# Altium schematic sheet mcu1_secondary.SchDoc: foxBMS BMS-Master
size A3; DocumentNumber: 11; SheetNumber: 11; SheetTotal: 24; Author: Fraunhofer IISB foxBMS Team; REL-DATE: 2017-05-16; VERSION: 1.0.2; SheetDescription: MCU1 (Secondary); ClassName: ISO_MCU_SEC
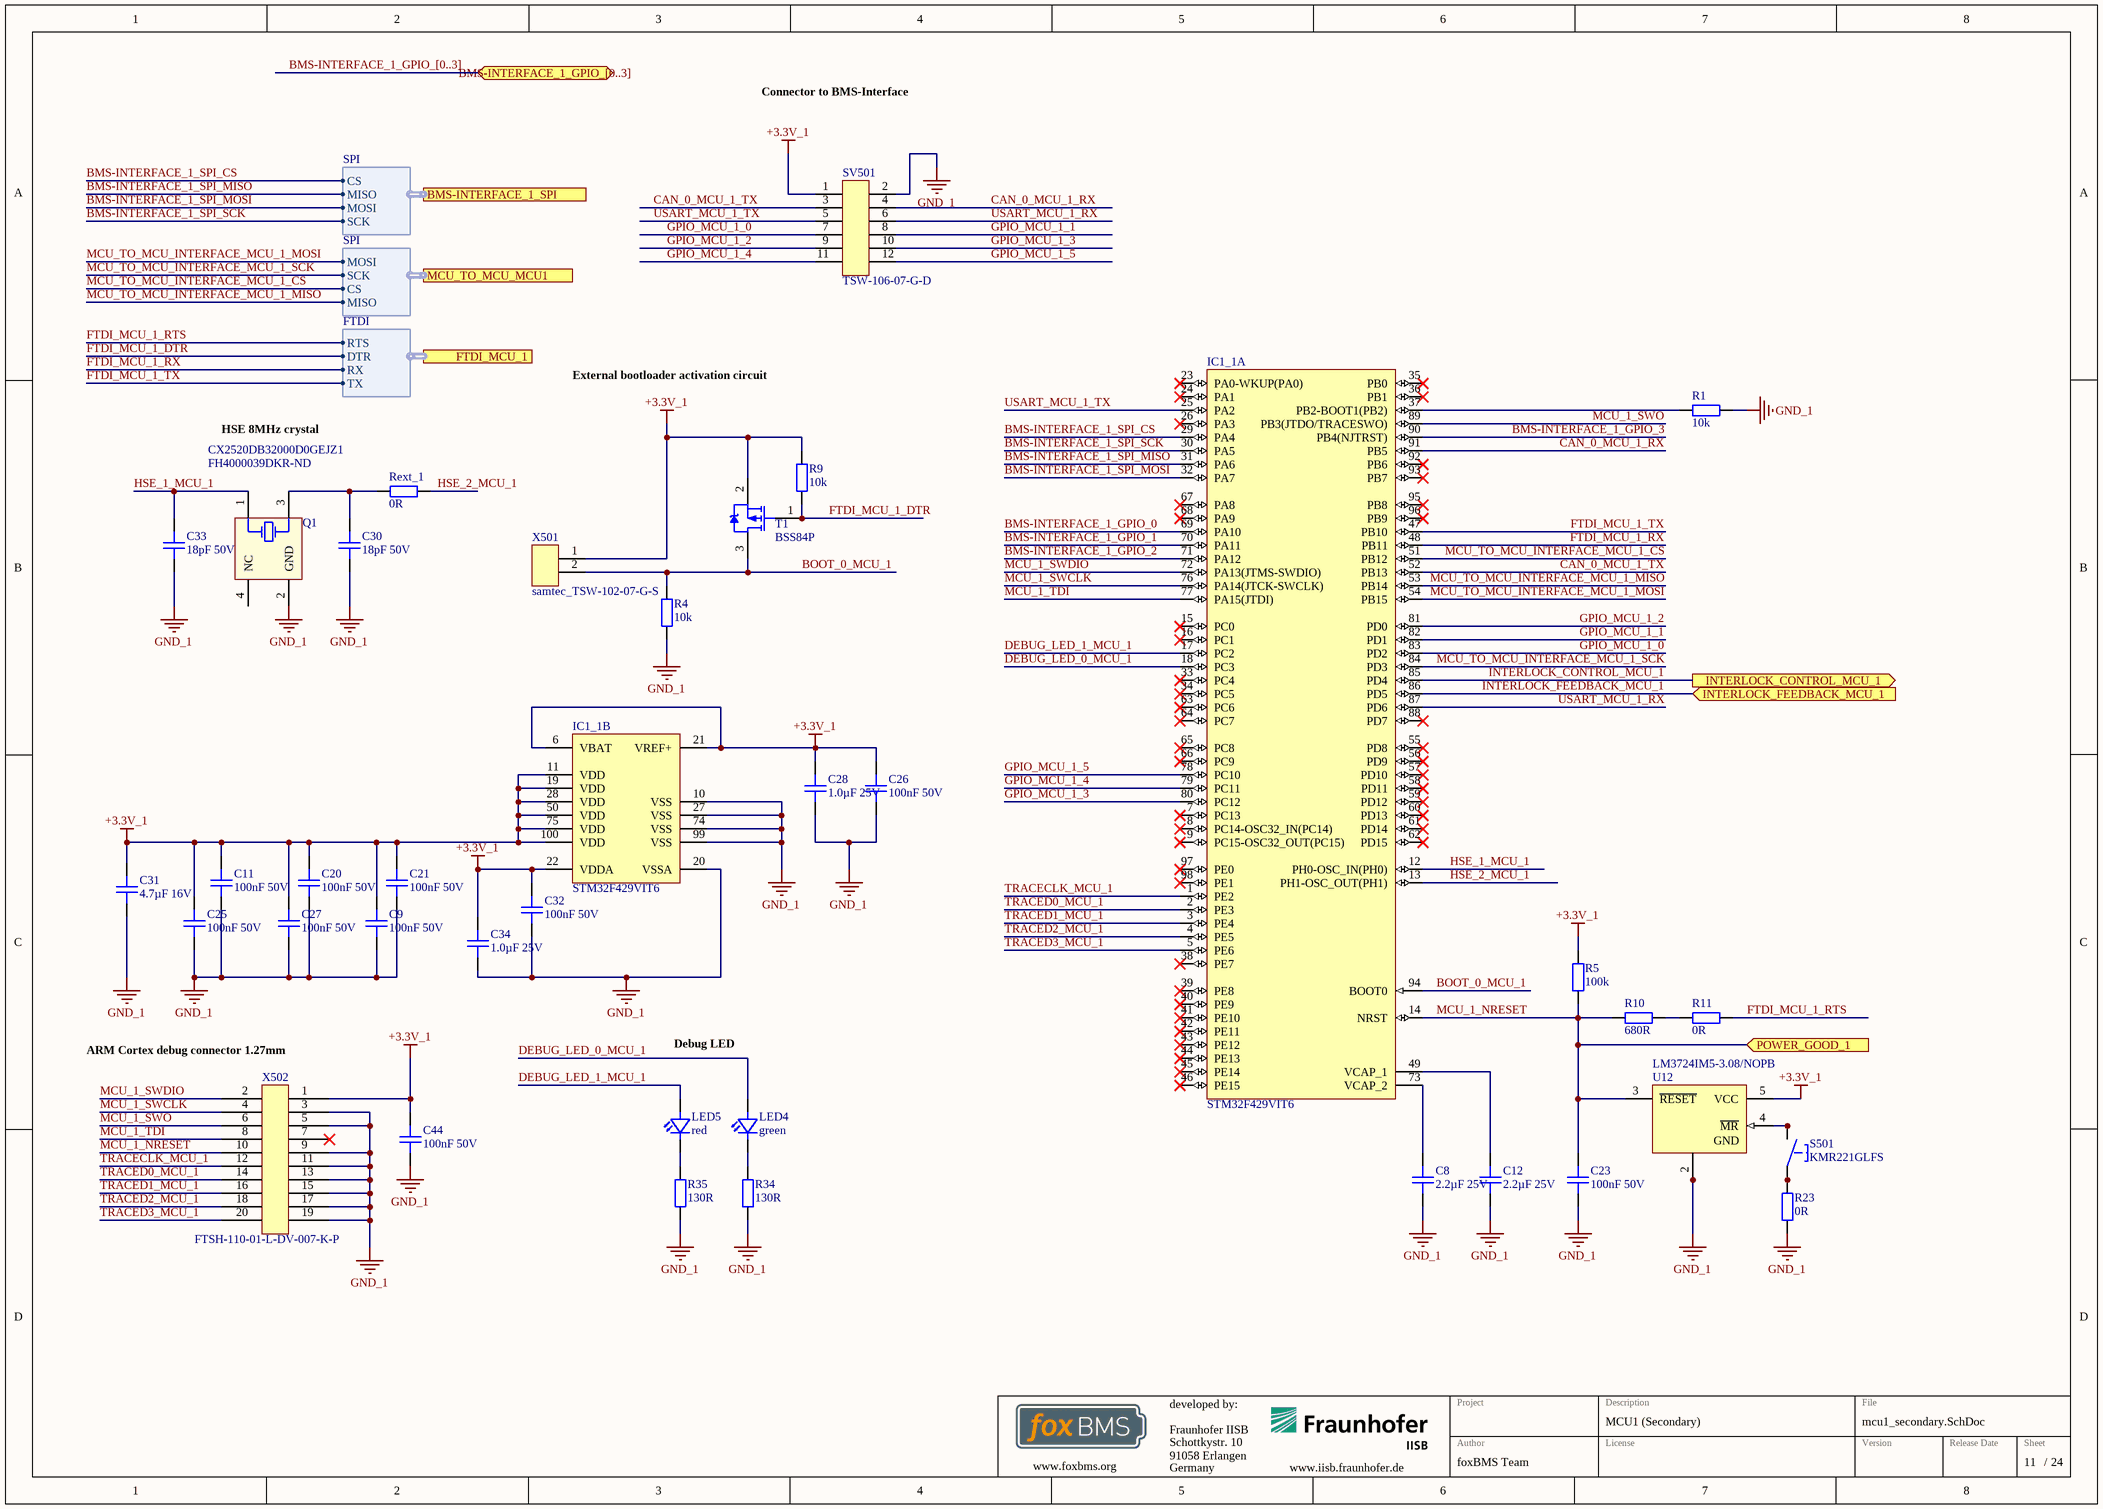
[diagram p0: mcu1_secondary.SchDoc]

## Parts
C8  2.2µF 25V  [0805C]
C9  100nF 50V  [0402C]
C11  100nF 50V  [0402C]
C12  2.2µF 25V  [0805C]
C20  100nF 50V  [0402C]
C21  100nF 50V  [0402C]
C23  100nF 50V  [0603C]
C25  100nF 50V  [0402C]
C26  100nF 50V  [0402C]
C27  100nF 50V  [0402C]
C28  1.0µF 25V  [0603C]
C30  18pF 50V  [0402C]
C31  4.7µF 16V  [0805C]
C32  100nF 50V  [0402C]
C33  18pF 50V  [0402C]
C34  1.0µF 25V  [0603C]
C44  100nF 50V  [0603C]
IC1_1  STM32F429VIT6  [STM-LQFP100_N]  (parts A,B of 2)
LED4  green  [LEDC1608X07N]
LED5  red  [LEDC1608X07N]
Q1  CX2520DB32000D0GEJZ1  Supplier Part Number 1: FH4000039DKR-ND  [AVX-CX2520DB32000D0GEJZ1-4_V]
R1  10k  [0603R]
R4  10k  [0603R]
R5  100k  [0603R]
R9  10k  [0603R]
R10  680R  [0603R]
R11  0R  [0603R]
R23  0R  [0603R]
R34  130R  [0603R]
R35  130R  [0603R]
Rext_1  0R  [0402R]
S501  KMR221GLFS  [KMR2_Series]
SV501  TSW-106-07-G-D  [Pinheader_2.54_2x6]
T1  BSS84P  [INF-PG-SOT23_N]
U12  LM3724IM5-3.08/NOPB  [MF05A_N]
X501  samtec_TSW-102-07-G-S  [Pinheader_2.54_2]
X502  FTSH-110-01-L-DV-007-K-P  [CORTEX_DEBUG_20_PIN]

## Ports
BMS-INTERFACE_1_GPIO_[0..3] (bidir), BMS-INTERFACE_1_SPI (harness SPI), FTDI_MCU_1 (harness FTDI), INTERLOCK_CONTROL_MCU_1 (out), INTERLOCK_FEEDBACK_MCU_1 (in), MCU_TO_MCU_MCU1 (harness SPI), POWER_GOOD_1 (in)

## Harnesses
SPI: CS, MISO, MOSI, SCK
FTDI: RTS, DTR, RX, TX

## Nets
+3.3V_1: C9.1 C11.1 C20.1 C21.1 C25.1 C26.1 C27.1 C28.1 C31.1 C32.1 C34.1 C44.1 IC1_1.6(VBAT) IC1_1.11(VDD) IC1_1.19(VDD) IC1_1.21(VREF+) IC1_1.22(VDDA) IC1_1.28(VDD) IC1_1.50(VDD) IC1_1.75(VDD) IC1_1.100(VDD) R5.2 R9.2 SV501.1 T1.2(SOURCE) U12.5(VCC) X501.1 X502.1
GND_1: C8.2 C9.2 C11.2 C12.2 C20.2 C21.2 C23.2 C25.2 C26.2 C27.2 C28.2 C30.2 C31.2 C32.2 C33.1 C34.2 C44.2 IC1_1.10(VSS) IC1_1.20(VSSA) IC1_1.27(VSS) IC1_1.74(VSS) IC1_1.99(VSS) Q1.2(GND) R1.1 R4.1 R23.1 R34.1 R35.1 SV501.2 U12.1(GND) U12.2(GND) X502.3 X502.5 X502.9 X502.11 X502.13 X502.15 X502.17 X502.19
BMS-INTERFACE_1_GPIO_0: IC1_1.69(PA10)
BMS-INTERFACE_1_GPIO_1: IC1_1.70(PA11)
BMS-INTERFACE_1_GPIO_2: IC1_1.71(PA12)
BMS-INTERFACE_1_GPIO_3: IC1_1.90(PB4(NJTRST))
BMS-INTERFACE_1_SPI_CS: IC1_1.29(PA4) ; port BMS-INTERFACE_1_SPI.CS
BMS-INTERFACE_1_SPI_MISO: IC1_1.31(PA6) ; port BMS-INTERFACE_1_SPI.MISO
BMS-INTERFACE_1_SPI_MOSI: IC1_1.32(PA7) ; port BMS-INTERFACE_1_SPI.MOSI
BMS-INTERFACE_1_SPI_SCK: IC1_1.30(PA5) ; port BMS-INTERFACE_1_SPI.SCK
BOOT_0_MCU_1: IC1_1.94(BOOT0) R4.2 T1.3(DRAIN) X501.2
CAN_0_MCU_1_RX: IC1_1.91(PB5) SV501.4
CAN_0_MCU_1_TX: IC1_1.52(PB13) SV501.3
DEBUG_LED_0_MCU_1: IC1_1.18(PC3) LED4.2(A)
DEBUG_LED_1_MCU_1: IC1_1.17(PC2) LED5.2(A)
FTDI_MCU_1_DTR: R9.1 T1.1(GATE) ; port FTDI_MCU_1.DTR
FTDI_MCU_1_RTS: R11.2 ; port FTDI_MCU_1.RTS
FTDI_MCU_1_RX: IC1_1.48(PB11) ; port FTDI_MCU_1.RX
FTDI_MCU_1_TX: IC1_1.47(PB10) ; port FTDI_MCU_1.TX
GPIO_MCU_1_0: IC1_1.83(PD2) SV501.7
GPIO_MCU_1_1: IC1_1.82(PD1) SV501.8
GPIO_MCU_1_2: IC1_1.81(PD0) SV501.9
GPIO_MCU_1_3: IC1_1.80(PC12) SV501.10
GPIO_MCU_1_4: IC1_1.79(PC11) SV501.11
GPIO_MCU_1_5: IC1_1.78(PC10) SV501.12
HSE_1_MCU_1: C33.2 IC1_1.12(PH0-OSC_IN(PH0)) Q1.1(HOT)
HSE_2_MCU_1: IC1_1.13(PH1-OSC_OUT(PH1)) Rext_1.1
INTERLOCK_CONTROL_MCU_1: IC1_1.85(PD4) ; port INTERLOCK_CONTROL_MCU_1
INTERLOCK_FEEDBACK_MCU_1: IC1_1.86(PD5) ; port INTERLOCK_FEEDBACK_MCU_1
MCU_1_NRESET: C23.1 IC1_1.14(NRST) R5.1 R10.1 U12.3(~{RESET}) X502.10 ; port POWER_GOOD_1
MCU_1_SWCLK: IC1_1.76(PA14(JTCK-SWCLK)) X502.4
MCU_1_SWDIO: IC1_1.72(PA13(JTMS-SWDIO)) X502.2
MCU_1_SWO: IC1_1.89(PB3(JTDO/TRACESWO)) X502.6
MCU_1_TDI: IC1_1.77(PA15(JTDI)) X502.8
MCU_TO_MCU_INTERFACE_MCU_1_CS: IC1_1.51(PB12) ; port MCU_TO_MCU_MCU1.CS
MCU_TO_MCU_INTERFACE_MCU_1_MISO: IC1_1.53(PB14) ; port MCU_TO_MCU_MCU1.MISO
MCU_TO_MCU_INTERFACE_MCU_1_MOSI: IC1_1.54(PB15) ; port MCU_TO_MCU_MCU1.MOSI
MCU_TO_MCU_INTERFACE_MCU_1_SCK: IC1_1.84(PD3) ; port MCU_TO_MCU_MCU1.SCK
TRACECLK_MCU_1: IC1_1.1(PE2) X502.12
TRACED0_MCU_1: IC1_1.2(PE3) X502.14
TRACED1_MCU_1: IC1_1.3(PE4) X502.16
TRACED2_MCU_1: IC1_1.4(PE5) X502.18
TRACED3_MCU_1: IC1_1.5(PE6) X502.20
USART_MCU_1_RX: IC1_1.87(PD6) SV501.6
USART_MCU_1_TX: IC1_1.25(PA2) SV501.5
NetC8_1: C8.1 IC1_1.73(VCAP_2)
NetC12_1: C12.1 IC1_1.49(VCAP_1)
NetC30_1: C30.1 Q1.3(HOT) Rext_1.2
NetIC1_1_37: IC1_1.37(PB2-BOOT1(PB2)) R1.2
NetLED4_1: LED4.1(C) R34.2
NetLED5_1: LED5.1(C) R35.2
NetR10_2: R10.2 R11.1
NetR23_2: R23.2 S501.1 S501.2
NetS501_3: S501.3 S501.4 U12.4(~{MR})

Not connected (* = marked no-connect by the designer): IC1_1 7(PC13)* 8(PC14-OSC32_IN(PC14))* 9(PC15-OSC32_OUT(PC15))* 15(PC0)* 16(PC1)* 23(PA0-WKUP(PA0))* 24(PA1)* 26(PA3)* 33(PC4)* 34(PC5)* 35(PB0)* 36(PB1)* 38(PE7)* 39(PE8)* 40(PE9)* 41(PE10)* 42(PE11)* 43(PE12)* 44(PE13)* 45(PE14)* 46(PE15)* 55(PD8)* 56(PD9)* 57(PD10)* 58(PD11)* 59(PD12)* 60(PD13)* 61(PD14)* 62(PD15)* 63(PC6)* 64(PC7)* 65(PC8)* 66(PC9)* 67(PA8)* 68(PA9)* 88(PD7)* 92(PB6)* 93(PB7)* 95(PB8)* 96(PB9)* 97(PE0)* 98(PE1)*; Q1 4(NC); X502 7*

## Buses and harness runs
bus BMS-INTERFACE_1_GPIO_[0..3] = port BMS-INTERFACE_1_GPIO_[0..3]

## Notes on the sheet
- Connector to BMS-Interface
- External bootloader activation circuit
- HSE 8MHz crystal
- (near X502) ARM Cortex debug connector 1.27mm
- Debug LED
- Fraunhofer IISB
- Schottkystr. 10
- developed by:
- 91058 Erlangen
- Germany
- Author
- Project
- License
- Description
- File
- Version
- Release Date
- Sheet
- www.foxbms.org
- www.iisb.fraunhofer.de
- foxBMS Team
- /

## Library data of the parts
C8 C12 = gen_C_ceramic_2u2_50V_X7R_0805: Ceramic, 2.2µF, ±10%, 25V, X7R, –55 to 125°C, 0805 (2012),RoHS, Automotive; Part Number: GCJ21BR71E225KA01; Manufacturer: Murata; Capacitance: 2u2; Case EIA: 0805; Case Metric: 2012; Automotive Qualified: True; PnP Package: C_0805_10; PnP Value: 2.2µF/25V/X7R; Rated Voltage: 25V; Dielectric: X7R; Height - Seated (Max): 1.25mm; Mounting Type: SurfaceMount,MLCC; Operating Temperature: –55 to 125°C; Series: GCJ; Tolerance: ±10%; Manufacturer_Part_Number: GCJ21BR71E225KA01
C9 C11 C20 C21 C25-C27 = gen_C_ceramic_100n_50V_X7R_0402: Ceramic, 100nF, ±10%, 50V, X7R, –55 to 125°C, 0402 (1005),RoHS, Automotive; Part Number: GCM155R71H104KE02; Manufacturer: Murata; Capacitance: 100n; Case EIA: 0402; Case Metric: 1005; PnP Package: C_0402_10; PnP Value: 100nF/50V/X7R; Automotive Qualified: True; PnP equipped: x; Rated Voltage: 50V; Dielectric: X7R; Supplier 1: Digi-Key; Supplier Part Number 1: 490-10672-1-ND; Height - Seated (Max): 0.5mm; Mounting Type: SurfaceMount,MLCC; Operating Temperature: –55 to 125°C; Series: GCM; Tolerance: ±10%; Manufacturer_Part_Number: GCM155R71H104KE02
C23 C44 = gen_C_ceramic_100n_50V_X7R_0603: Ceramic, 100nF, ±10%, 50V, X7R, –55 to 125°C, 0603 (1608),RoHS, Automotive; Part Number: GCJ188R71H104KA12; Manufacturer: Murata; Capacitance: 100n; Case EIA: 0603; Case Metric: 1608; PnP Package: C_0603_10; PnP Value: 100nF/50V/X7R; PnP equipped: x; Automotive Qualified: True; Rated Voltage: 50V; Dielectric: X7R; Supplier 1: Digi-Key; Supplier Part Number 1: 490-5798-1-ND; Height - Seated (Max): 0.8mm; Mounting Type: SurfaceMount,MLCC; Operating Temperature: –55 to 125°C; Series: GCJ; Tolerance: ±10%; Manufacturer_Part_Number: GCJ188R71H104KA12
C28 C34 = gen_C_ceramic_1u_25V_X7R_0603: Ceramic, 1.0µF, ±10%, 25V, X7R, –55 to 125°C, 0603 (1608),RoHS, Automotive; Part Number: GCJ188R71E105KA01; Manufacturer: Murata; Capacitance: 1µF; Case EIA: 0603; Case Metric: 1608; PnP Package: C_0603_10; PnP Value: 1.0µF/25V/X7R; Automotive Qualified: True; Rated Voltage: 25V; Dielectric: X7R; Supplier 1: Digi-Key; Supplier Part Number 1: 490-14409-1-ND; Height - Seated (Max): 0.8mm; Mounting Type: SurfaceMount,MLCC; Operating Temperature: –55 to 125°C; Series: GCJ; Tolerance: ±10%; Manufacturer_Part_Number: GCJ188R71E105KA01
C30 C33 = gen_C_ceramic_18p_50V_C0G_0402: Ceramic, 18pF, ±5%, 50V, X7R, 25 to 125°C, 0402 (1005),RoHS, Automotive; Part Number: GCM1555C1H180JA16#; Manufacturer: Murata; Capacitance: 18p; Dielectric: C0G; Case EIA: 0402; Case Metric: 1005; Automotive Qualified: True; PnP Package: C_0402_10; PnP Value: 18pF/50V/X7R; Rated Voltage: 50V; Supplier 1: Digi-Key; Supplier Part Number 1: 490-12650-1-ND; Height - Seated (Max): 0.5mm; Mounting Type: SurfaceMount,MLCC; Operating Temperature: 25 to 125°C; Series: GCM; Tolerance: ±5%; Manufacturer_Part_Number: GCM1555C1H180JA16#
C31 = gen_C_ceramic_4u7_16V_X7R_0805: Ceramic, 4.7µF, ±10%, 16V, X7R, –55 to 125°C, 0805 (2012),RoHS, Automotive; Part Number: GCJ21BR71C475KA01; Manufacturer: Murata; Capacitance: 4u7; Case EIA: 0805; Case Metric: 2012; AVT Set: x; Automotive Qualified: True; PnP Package: C_0805_10; PnP Value: 4.7µF/16V/X7R; Rated Voltage: 16V; Dielectric: X7R; Supplier 1: Digi-Key; Supplier Part Number 1: 490-10557-1-ND; Height - Seated (Max): 1.25mm; Mounting Type: SurfaceMount,MLCC; Operating Temperature: –55 to 125°C; Series: GCJ; Tolerance: ±10%; Manufacturer_Part_Number: GCJ21BR71C475KA01
C32 = gen_C_ceramic_100n_50V_X7R_0402: Ceramic, 100nF, ±10%, 50V, X7R, –55 to 125°C, 0402 (1005),RoHS, Automotive; Part Number: GCM155R71H104KE02; Manufacturer: Murata; Capacitance: 100n; Case EIA: 0402; Case Metric: 1005; PnP Package: C_0402_10; PnP Value: 100nF/50V/X7R; PnP equipped: x; Automotive Qualified: True; Rated Voltage: 50V; Dielectric: X7R; Supplier 1: Digi-Key; Supplier Part Number 1: 490-10672-1-ND; Height - Seated (Max): 0.5mm; Mounting Type: SurfaceMount,MLCC; Operating Temperature: –55 to 125°C; Series: GCM; Tolerance: ±10%; Manufacturer_Part_Number: GCM155R71H104KE02
IC1_1 = CMP-0243-00030-2: ARM Cortex-M4 32-bit MCU+FPU, 225 DMIPS, 2048 kB Flash, 256 kB Internal RAM, 82 I/Os, 100-pin LQFP, -40 to 85 degC, Tray; Manufacturer: STMicroelectronics; FLASH Size (Prog) (kB): 2048; Supply Voltage(Vcc) min (V): 1.8; Operating Frequency(F) (Processor speed) (MHz): 180; Supply Voltage(Vcc) max (V): 3.6; D/A Converter: 2x12-bit; Internal RAM Size (kB): 256; I/Os (High Current): 82; Mounting Technology: Surface Mount; ComponentLink3URL: http://www.st.com/st-web-ui/static/active/en/resource/technical/document/data_brief/DM00071938.pdf; ComponentLink2URL: http://www.st.com/st-web-ui/static/active/en/resource/technical/document/data_brief/DM00053488.pdf; ComponentLink3Description: Package Specification; Packing: Tray; PackageDescription: 100-Pin Low Profile Quad Flat Package, 14 x 14 mm Body, 0.5 mm Pitch; PartNumber: STM32F429VIT6; ComponentLink2Description: Datasheet; ComponentLink1Description: Manufacturer URL; ComponentLink1URL: http://www.st.com/web/en/home.html; DatasheetVersion: Rev. 2; Core: ARM Cortex-M4; PackageReference: LQFP100; PackageVersion: Rev. 1, 06/2013; Part Number: STM32F429VIT6
LED4 = gen_LED_0603_green: LED; Breakdown Voltage: 5V; Continuous Forward Current: 20mA; Forward Voltage @ 20mA: 2.2V; Automotive Qualified: False; Case EIA: 0603; Case Metric: 1608; Part Number: gen_LED_0603_green; Color: green; PnP Package: LED_0603; Supplier 1: Farnell; Supplier Part Number 1: 2099223
LED5 = gen_LED_0603_red: LED; Breakdown Voltage: 5V; Continuous Forward Current: 20mA; Forward Voltage @ 20mA: 2V; Automotive Qualified: False; Case EIA: 0603; Case Metric: 1608; Part Number: gen_LED_0603_red; Color: red; PnP Package: LED_0603; Supplier 1: Farnell; Supplier Part Number 1: 2099221
Q1 = CMP-0449-00001-1: Crystal,CRYSTAL 40MHZ 15PF 85degC Surface Mount 2.5 x 2.0 mm; Manufacturer: Kyocera; Drive Level: 10uW (100uW max.); Motional Series Resistance: 50 ohm (max); Frequency Range: 32000 kHz; Load Capacitance: 8 pF; Packing: Tape and Reel; ComponentLink2URL: http://global.kyocera.com/prdct/electro/pdf/xtal/cx2520db_cs_e.pdf; ComponentLink1Description: Manufacturer URL; PackageDescription: 4-Pin Hand Drawnï¼ŒBody 2.5x2mm; ComponentLink1URL: http://global.kyocera.com/; ComponentLink3URL: http://global.kyocera.com/prdct/electro/pdf/xtal/cx2520db_cs_e.pdf; ComponentLink2Description: Datasheet; PackageReference: CX2520DB32000D0GEJZ1-4; Operating Temperature: -10 to 70 degC; PartNumber: CX2520DB32000D0GEJZ1; ComponentLink3Description: Package Specification; Mounting Technology: Surface Mount; Supplier 1: Digi-Key
R1 R4 R9 = gen_R_10k_0603: SMD Resistor 10k 0603; Tolerance: 1%; Power: 0.1W; Case EIA: 0603; Case Metric: 1608; Maximum Working Voltage: 75V; PnP Package: R_0603; Automotive Qualified: False; Part Number: gen_R_10k_0603; Operating Temperature: -55°C - +155°C; Resistance: 10k; Series: E24, E96; PnP Value: 10k; Supplier 1: Farnell; Supplier Part Number 1: 2073349
R5 = gen_R_100k_0603: SMD Resistor 100k 0603; Case EIA: 0603; Case Metric: 1608; PnP Package: R_0603; Automotive Qualified: False; Part Number: gen_R_100k_0603; Operating Temperature: -55°C - +155°C; PnP Value: 100k
R10 = gen_R_680R_0603: SMD Resistor 680R 0603; Tolerance: 1%; Power: 0.1W; Case EIA: 0603; Case Metric: 1608; Maximum Working Voltage: 75V; PnP Package: R_0603; Automotive Qualified: False; Part Number: gen_R_680R_0603; Operating Temperature: -55°C - +155°C; Resistance: 680R; Series: E24; PnP Value: 680R; Supplier 1: Farnell; Supplier Part Number 1: 2797303
R11 R23 = gen_R_0R_0603: SMD Resistor 0R 0603; Power: 0.1W; Case EIA: 0603; Case Metric: 1608; PnP Package: R_0603; Maximum Working Voltage: 75V; Automotive Qualified: False; Part Number: gen_R_0R_0603; Operating Temperature: -55°C - +155°C; Resistance: 0R; Series: Jumper; PnP Value: 0R; Supplier 1: Farnell; Supplier Part Number 1: 2073345
R34 R35 = gen_R_130R_0603: SMD Resistor 130R 0603; Tolerance: 1%; Power: 0.1W; Case EIA: 0603; Case Metric: 1608; Maximum Working Voltage: 75V; PnP Package: R_0603; Automotive Qualified: False; Part Number: gen_R_130R_0603; Operating Temperature: -55°C - +155°C; Resistance: 130R; Series: E24, E96; PnP Value: 130R; Supplier 1: Farnell; Supplier Part Number 1: 2379959
Rext_1 = gen_R_0R_0402: SMD Resistor 0R 0402; Case EIA: 0402; Case Metric: 1005; PnP Package: R_0402; Automotive Qualified: False; Part Number: gen_R_0R_0402; PnP Value: 0R; Operating Temperature: -55°C - +155°C
S501 = KMR221GLFS: Microminiature Tactile Switch; Manufacturer: CK Components; Automotive Qualified: False; Part Number: KMR221GLFS; Operating Temperature: -40°C - +85°C; ComponentLink1Description: Datasheet; ComponentLink1URL: http://www.farnell.com/datasheets/1685525.pdf; Supplier 1: Farnell; Supplier Part Number 1: 1201424; Supplier 2: Digikey; Supplier Part Number 2: 401-1426-1-ND; Supplier 3: Mouser; Supplier Part Number 3: 611-KMR211G-LFS
SV501 = samtec_TSW-106-07-G-D: Board-To-Board Connector, Vertical, 2.54 mm, 12 Contacts, Header, TSW Series, Through Hole, 2 Rows; Manufacturer: Samtec; Circuits: 12; Rated Voltage: 500V AC mated with SSW; Automotive Qualified: False; Part Number: TSW-106-07-G-D; Part Name: TSW-106-07-G-D; Operating Temperature: -55°C - +125°C; ComponentLink1Description: Datasheet; ComponentLink1URL: http://www.farnell.com/datasheets/1992055.pdf?_ga=2.196729640.569325269.1503285096-1413671594.1503025027; Supplier 1: Farnell; Supplier Part Number 1: 2025252
T1 = CMP-1099-00028-1: P-Channel SIPMOS Small-Signal-Transistor, -60 V VDS, -0.17 A ID, -55 to 150 degC, PG-SOT23, Reel, Green; Manufacturer: Infineon; VGS(th) (max): -2Â V; VGS(th) (min): -1Â V; VDS (max): -60Â V; Rth: 350Â K/W; Pto t (max): 0.36Â W; ID (max): -0.17Â A; IDpuls (max): -0.68Â A; RDS (on) (max) (@4.5V): 12,000Â mOhm; QG: 1Â nC; Green: TRUE; RDS (on) (max): 8,000Â mOhm; ComponentLink3URL: http://www.infineon.com/dgdl/SOT23-Package_Overview.pdf?folderId=db3a30431936bc4b0119532290053c66&fileId=db3a30431936bc4b0119533468123c85; ComponentLink3Description: Package Specification; Packing: Reel; PartNumber: BSS84P; ComponentLink2Description: Datasheet; Mounting Technology: Surface Mount; ComponentLink2URL: http://www.infineon.com/dgdl/BSS84P_Rev2.7%5B1%5D.pdf?folderId=db3a304314dca38901154a72e3951a65&fileId=db3a304330f68606013118ac7a9b4549; PackageReference: PG-SOT23; ComponentLink1URL: http://www.infineon.com/; PackageVersion: Apr-08; ComponentLink1Description: Manufacturer URL; PackageDescription: 3-Pin Small Outline Transistor Package, 2.9 x 1.3 mm Body, 0.95 mm Pitch; Halogen-free: TRUE; DatasheetVersion: Rev. 2.7; Part Number: BSS84P
U12 = CMP-0063-01088-2: 5-Pin Microprocessor Reset Circuits, 5-pin SOT-23, Pb-Free; Manufacturer: National Semiconductor; PowerWise: N; PackageTopMarking: R53B*XTT; CompType: MiscPower; PackageVersion: revD, Aug-2008; ComponentLink3URL: http://www.national.com/packaging/folders/mf05a.html; ComponentLink2URL: http://www.national.com/pf/LM/LM3724.html; PinCount: 5; ComponentLink2Description: LM3724 Web Page; PackageDescription: Molded SOT-23, .115 x .063 x .040 in Body, 5 Lead, .0375 in Pitch; ComponentLink3Description: MF05A Package Page; ComponentLink1Description: LM3724 Datasheet; RevisionNote: Component URLs added; RoHS: Y; ComponentLink1URL: http://www.national.com/ds/LM/LM3724.pdf; DatasheetVersion: Jul-2007; PackageReference: MF05A
X501 = samtec_TSW-102-07-G-S: Board-To-Board Connector, Vertical, 2.54 mm, 2 Contacts, Header, TSW Series, Through Hole, 1 Row; Manufacturer: Samtec; Circuits: 2; Automotive Qualified: False; Part Number: samtec_TSW-102-07-G-S; Part Name: TSW-102-07-G-S; Operating Temperature: -55°C - +125°C; ComponentLink1Description: Datasheet; ComponentLink1URL: http://www.farnell.com/datasheets/1796313.pdf; Supplier 1: Farnell; Supplier Part Number 1: 2505044
X502 = samtec_FTSH-110-01-L-DV-007-K-P: Board-To-Board Connector, ARM Cortex Debug Header 20 Pin; Manufacturer: Samtec; Circuits: 20; Automotive Qualified: False; Part Number: samtec_FTSH-110-01-L-DV-007-K-P; Part Name: FTSH-110-01-L-DV-007-K-P; Operating Temperature: -55°C - +125°C; Supplier 1: Digikey; Supplier Part Number 1: SAM11268-ND; Supplier 2: Avnet; Supplier Part Number 2: FTSH-110-01-L-DV-007-K-P